# EasyEDA Pro project USB Hub.epro

# Schematic Schematic1
Board Name: Board1; Create Date: 2026-05-04; Page Name: P1; Project Name: USB Hub; Schematic Name: Schematic1; Update Date: 2026-05-04; Company: EasyEDA.com; Page Size: A4; Version: V1.0
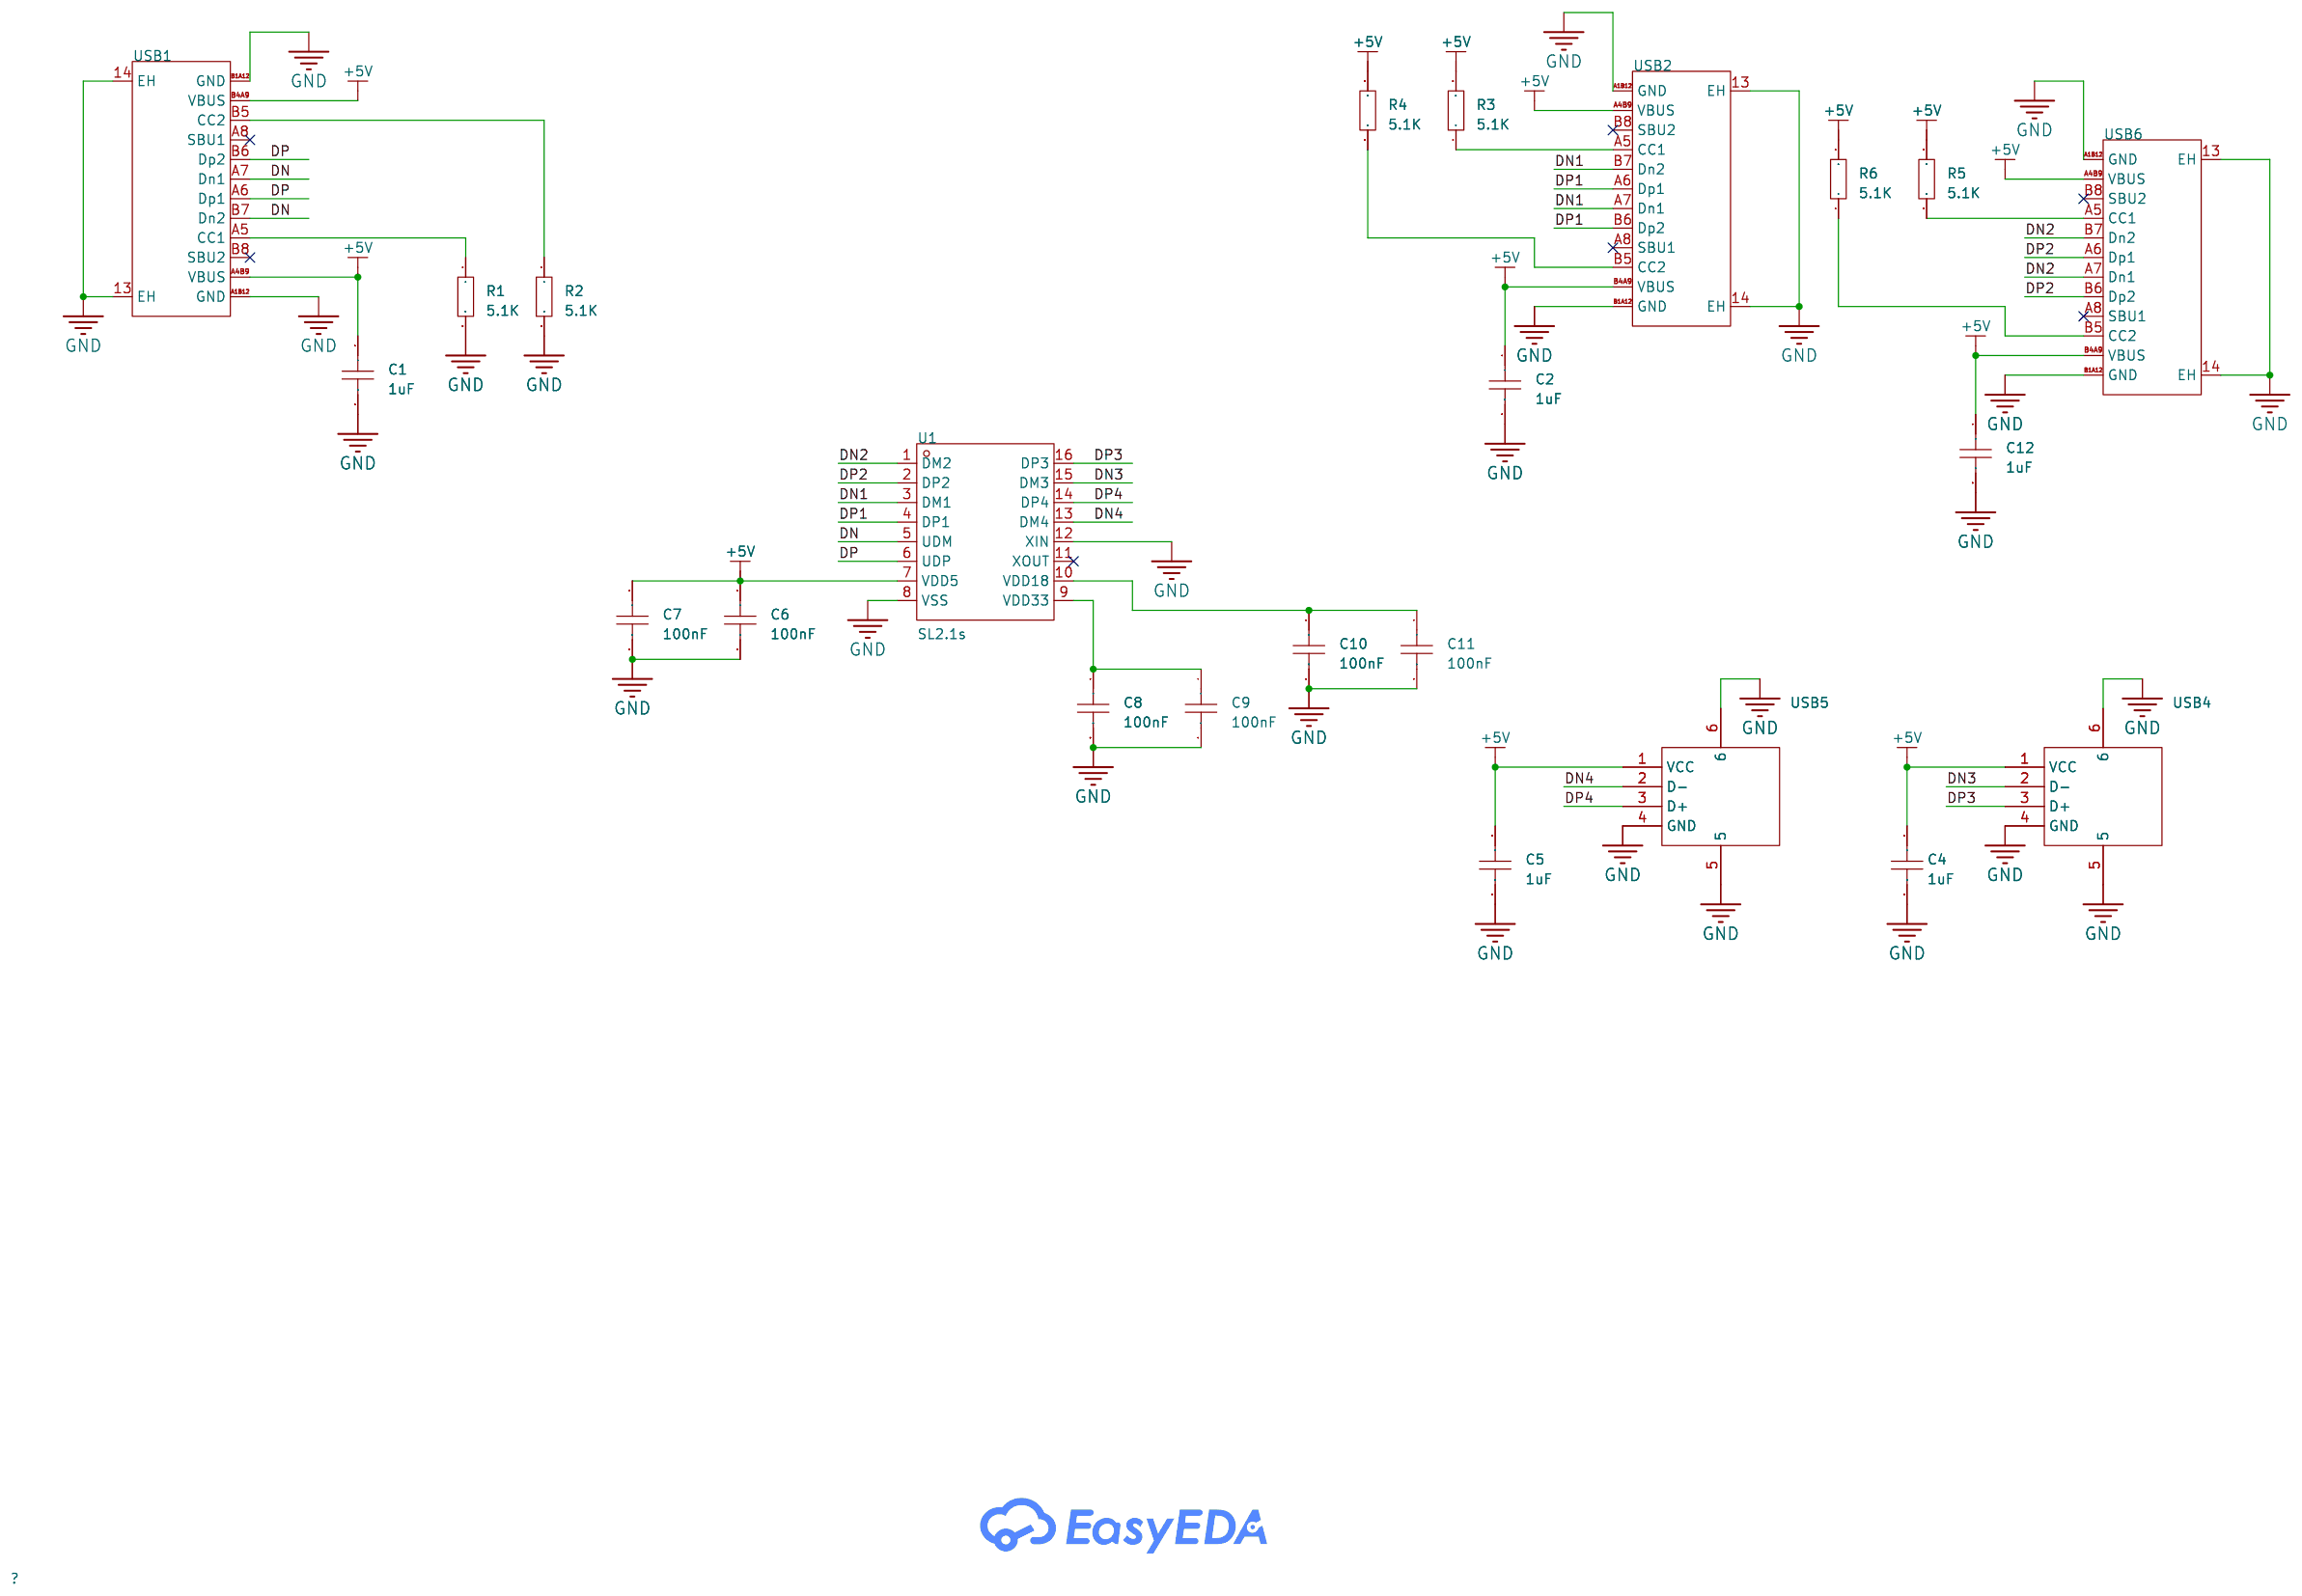
[diagram p0: schematic sheet]

## Parts
C1  1uF  [C0603]
C2  1uF  [C0603]
C4  1uF  [C0603]
C5  1uF  [C0603]
C6  100nF  [C0603]
C7  100nF  [C0603]
C8  100nF  [C0603]
C9  100nF  [C0603]
C10  100nF  [C0603]
C11  100nF  [C0603]
C12  1uF  [C0603]
R1  5.1K  [R0603]
R2  5.1K  [R0603]
R3  5.1K  [R0603]
R4  5.1K  [R0603]
R5  5.1K  [R0603]
R6  5.1K  [R0603]
U1  SL2.1s  [SSOP-16_L4.6-W2.6-P0.53-LS4.0-BL]
USB1  TYPE-C 16PIN 2MD(073)  [USB-C-SMD_TYPE-C-16PIN-2MD-073]
USB2  TYPE-C 16PIN 2MD(073)  [USB-C-SMD_TYPE-C-16PIN-2MD-073]
USB4  10.0 QHHTZB6.3  [USB-A-TH_10.0QHHTZB6.3]
USB5  10.0 QHHTZB6.3  [USB-A-TH_10.0QHHTZB6.3]
USB6  TYPE-C 16PIN 2MD(073)  [USB-C-SMD_TYPE-C-16PIN-2MD-073]

## Library data of the parts
C1 C2 C4-C12 = CAP_0603: Supplier Footprint: 0603
R1-R6 = Res_0603: Supplier Footprint: 0603
U1 = SL2.1s: type:Hub USB Protocol:USB 2.0 Data Rate:- Voltage - Supply:4V~5.25V Voltage - Supply:4V~5.25V Operating Temperature:0℃~+70℃ Operating Temperature:0℃~+70℃ Memory Interface:- Current - Supply:120mA Quiescent Supply Current:2.5mA Number of Channels:4; LCSC Part Name: USB2.0 HUB控制器集成电路; Supplier Part: C2684433; Manufacturer: CoreChips(和芯润德); Supplier Footprint: SSOP-16; JLCPCB Part Class: Extended Part; Datasheet: https://item.szlcsc.com/datasheet/SL2.1s/2782346.html; Supplier: LCSC; type: Hub; USB Protocol: USB 2.0; Voltage - Supply: 4V~5.25V; Operating Temperature: 0℃~+70℃; Current - Supply: 120mA; Quiescent Supply Current: 2.5mA; Number of Channels: 4
USB1 USB2 USB6 = TYPE-C 16PIN 2MD(073): Connector Type:Type-C Protocol Standard:- Gender:Female Mounting Type:Surface Mount, Right Angle Number of Contacts:16P Number of Ports:1 Current Rating-Power:3A Voltage Rating:5V Connect-Disconnect Life:10,000 Cycles Supplementary Features:- Center Heigh; LCSC Part Name: Type-C 母 卧贴; Supplier Part: C2765186; Manufacturer: SHOU HAN(首韩); Supplier Footprint: SMD; JLCPCB Part Class: Extended Part; Datasheet: https://item.szlcsc.com/datasheet/TYPE-C%252016PIN%25202MD(073)/2901843.html; Supplier: LCSC; Connector Type: Type-C; Gender: Female; Mounting Type: Surface Mount, Right Angle; Number of Contacts: 16P; Number of Ports: 1; Current Rating-Power: 3A; Voltage Rating: 5V; Connect-Disconnect Life: 10,000 Cycles; Detection color: Black; Operating Temperature: -25℃~+85℃
USB4 USB5 = 10.0 QHHTZB6.3: Connector Type:Type-A Protocol Standard:USB 2.0 Gender:Female Mounting Type:Surface Mount, Right Angle Number of Contacts:4P Number of Ports:1 Current Rating-Power:1.5A Voltage Rating:30V Connect-Disconnect Life:5,000 times Supplementary Features:- Center; LCSC Part Name: 壳长10.0mm; Supplier Part: C668591; Manufacturer: SHOU HAN(首韩); Supplier Footprint: SMD; JLCPCB Part Class: Extended Part; Datasheet: https://item.szlcsc.com/datasheet/10.0%2520QHHTZB6.3/698534.html; Supplier: LCSC; Connector Type: Type-A; Protocol Standard: USB 2.0; Gender: Female; Mounting Type: Surface Mount, Right Angle; Number of Contacts: 4P; Number of Ports: 1; Current Rating-Power: 1.5A; Voltage Rating: 30V; Connect-Disconnect Life: 5,000 times; Length: 10mm; Detection color: Black; Operating Temperature: -25℃~+85℃

## Nets
+5V: C1.1 C2.1 C4.1 C5.1 C6.1 C7.1 C12.1 R3.2 R4.2 R5.2 R6.2 U1.7(VDD5) USB1.A4B9(VBUS) USB1.B4A9(VBUS) USB2.A4B9(VBUS) USB2.B4A9(VBUS) USB4.1(VCC) USB5.1(VCC) USB6.A4B9(VBUS) USB6.B4A9(VBUS)
GND: C1.2 C2.2 C4.2 C5.2 C6.2 C7.2 C8.2 C9.2 C10.2 C11.2 C12.2 R1.2 R2.2 U1.8(VSS) U1.12(XIN) USB1.13(EH) USB1.14(EH) USB1.A1B12(GND) USB1.B1A12(GND) USB2.13(EH) USB2.14(EH) USB2.A1B12(GND) USB2.B1A12(GND) USB4.4(GND) USB4.5 USB4.6 USB5.4(GND) USB5.5 USB5.6 USB6.13(EH) USB6.14(EH) USB6.A1B12(GND) USB6.B1A12(GND)
DN: U1.5(UDM) USB1.A7(Dn1) USB1.B7(Dn2)
DN1: U1.3(DM1) USB2.A7(Dn1) USB2.B7(Dn2)
DN2: U1.1(DM2) USB6.A7(Dn1) USB6.B7(Dn2)
DN3: U1.15(DM3) USB4.2(D-)
DN4: U1.13(DM4) USB5.2(D-)
DP: U1.6(UDP) USB1.A6(Dp1) USB1.B6(Dp2)
DP1: U1.4(DP1) USB2.A6(Dp1) USB2.B6(Dp2)
DP2: U1.2(DP2) USB6.A6(Dp1) USB6.B6(Dp2)
DP3: U1.16(DP3) USB4.3(D+)
DP4: U1.14(DP4) USB5.3(D+)
$1N1728: R1.1 USB1.A5(CC1)
$1N1733: R2.1 USB1.B5(CC2)
$1N2038: R3.1 USB2.A5(CC1)
$1N2146: R4.1 USB2.B5(CC2)
$1N2912: C8.1 C9.1 U1.9(VDD33)
$1N2936: C10.1 C11.1 U1.10(VDD18)
$1N3312: R6.1 USB6.B5(CC2)
$1N3317: R5.1 USB6.A5(CC1)

Not connected (* = marked no-connect by the designer): U1 11(XOUT)*; USB1 A8(SBU1)* B8(SBU2)*; USB2 A8(SBU1)* B8(SBU2)*; USB6 A8(SBU1)* B8(SBU2)*

# Board PCB1
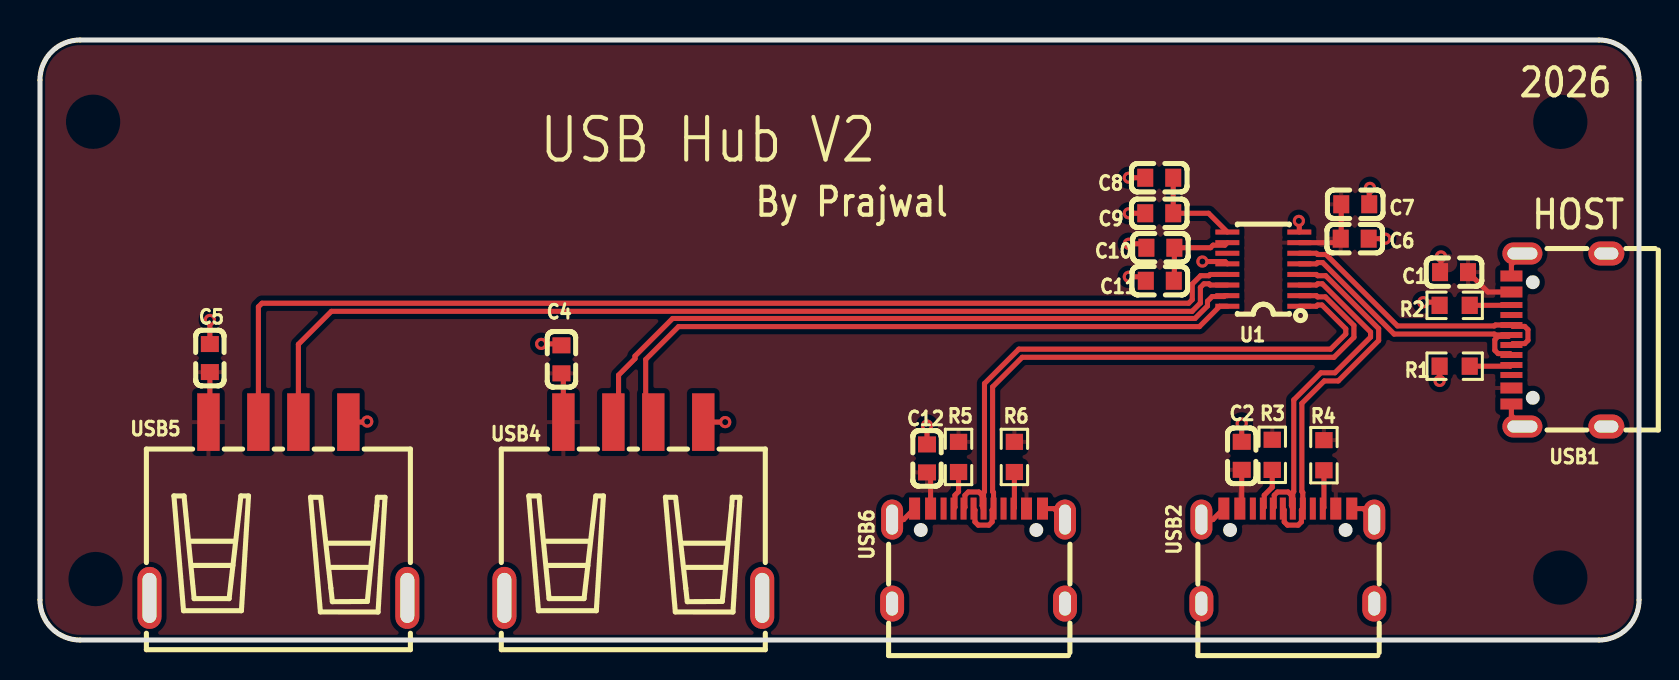
[diagram p1: board, top side]
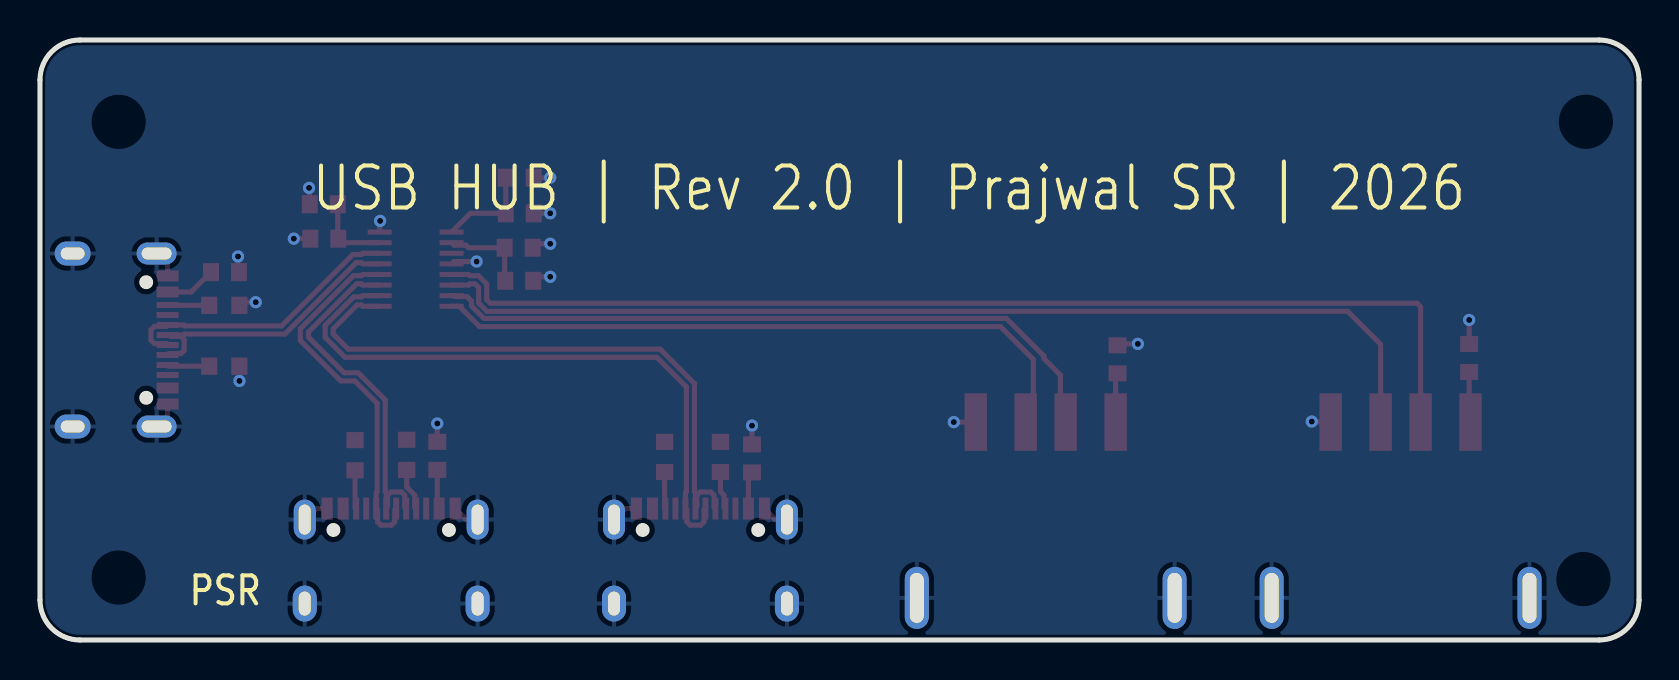
[diagram p2: board, bottom side, seen from below]

Outline 80 x 30 mm; copper layers: Top Layer, Bottom Layer. Coordinates in mm from the lower left corner of the outline.
Outline path: 0,28 0,2 arc(0.59,0.59) 2,0 78,0 arc(79.41,0.59) 80,2 80,28 arc(79.41,29.41) 78,30 2,30 arc(0.59,29.41) 0,28
Stack: Top Layer 0.035mm / Dielectric1 1.51mm FR4 er 4.5 / Bottom Layer 0.035mm

## Design rules (mm)
net DN2: DP5
net DP2: DP5
net DN1: DP3
net DP1: DP3
net DN: DP2
net DP: DP2
net DN4: DP1
net DP4: DP1
net DN3: DP4
net DP3: DP4
template: Custom Config
spacing copperThickness1oz (default): track to track 0.102, other pairs 0.152 to 0.3
spacing copperThickness2oz: track to track 0.203, other pairs 0.152 to 0.3
track width copperThickness1oz (default): min 0.127, default 0.254, max 2.54
track width copperThickness2oz: min 0.203, default 0.254, max 2.54
differential pair differentialPair (default): width min 0.127, default 0.254, max 2.54; gap min 0.152, default 0.152
via viaSize (default): diameter min 0.5, default 0.61, max 10; hole min 0.3, default 0.305, max 6.3

## Placement (name value [footprint] x y rotation side)
C1  1uF  [C0603]  70.74 18.39 180 top
C2  1uF  [C0603]  60.12 9.21 90 top
C4  1uF  [C0603]  26.09 14.03 90 top
C5  1uF  [C0603]  8.5 14.1 90 top
C6  100nF  [C0603]  65.78 20.07 0 top
C7  100nF  [C0603]  65.8 21.79 0 top
C8  100nF  [C0603]  56 23.11 180 top
C9  100nF  [C0603]  56 21.34 180 top
C10  100nF  [C0603]  56.05 19.61 180 top
C11  100nF  [C0603]  56.02 17.96 180 top
C12  1uF  [C0603]  44.38 9.08 90 top
R1  5.1K  [R0603]  70.78 13.69 180 top
R2  5.1K  [R0603]  70.78 16.73 180 top
R3  5.1K  [R0603]  61.65 9.26 90 top
R4  5.1K  [R0603]  64.24 9.24 90 top
R5  5.1K  [R0603]  45.96 9.15 90 top
R6  5.1K  [R0603]  48.75 9.15 90 top
U1  SL2.1s  [SSOP-16_L4.6-W2.6-P0.53-LS4.0-BL]  61.2 18.54 90 top
USB1  TYPE-C 16PIN 2MD(073)  [USB-C-SMD_TYPE-C-16PIN-2MD-073]  75.99 15 90 top
USB2  TYPE-C 16PIN 2MD(073)  [USB-C-SMD_TYPE-C-16PIN-2MD-073]  62.43 4.2 0 top
USB4  10.0 QHHTZB6.3  [USB-A-TH_10.0QHHTZB6.3]  29.68 6.5 0 top
USB5  10.0 QHHTZB6.3  [USB-A-TH_10.0QHHTZB6.3]  11.93 6.5 0 top
USB6  TYPE-C 16PIN 2MD(073)  [USB-C-SMD_TYPE-C-16PIN-2MD-073]  46.96 4.2 0 top

## Footprints (pads in the part's own frame, mm; a bottom-side part is the same pattern mirrored in y, then rotated)
C0603
  rect 0.8x0.9 smd: 1(-0.7,0) 2(0.7,0)
R0603
  rect 0.806x0.864 smd: 1(-0.753,0) 2(0.753,0)
SSOP-16_L4.6-W2.6-P0.53-LS4.0-BL
  rect 0.25x1.2 smd: 1(-1.855,-1.8) 2(-1.325,-1.8) 3(-0.795,-1.8) 4(-0.265,-1.8) 5(0.265,-1.8) 6(0.795,-1.8) 7(1.325,-1.8) 8(1.855,-1.8) 9(1.855,1.8) 10(1.325,1.8) 11(0.795,1.8) 12(0.265,1.8) 13(-0.265,1.8) 14(-0.795,1.8) 15(-1.325,1.8) 16(-1.855,1.8)
USB-A-TH_10.0QHHTZB6.3
  rect 1.12x2.88 smd: 1(-3.5,4.395) 2(-1,4.395) 3(1,4.395) 4(3.5,4.395)
  oval 1.2x3.1 hole 0.7x2.5: 5(-6.45,-4.395) 6(6.45,-4.395)
USB-C-SMD_TYPE-C-16PIN-2MD-073
  oval 1.1x2 hole 0.6x1.5: 13(-4.325,1.825) 14(4.325,1.825)
  oval 1.2x1.8 hole 0.6x1.2: 13(-4.325,-2.375) 14(4.325,-2.375)
  rect 0.55x1.1 smd: A1B12(-3.2,2.375) A4B9(-2.4,2.375) B1A12(3.2,2.375) B4A9(2.4,2.375)
  rect 0.3x1.1 smd: A5(-1.25,2.375) A6(-0.25,2.375) A7(0.25,2.375) A8(1.25,2.375) B5(1.75,2.375) B6(0.75,2.375) B7(-0.75,2.375) B8(-1.75,2.375)

## Nets
As in the schematic.

Pads without a net: U1 11; USB1 A8 B8; USB2 A8 B8; USB6 A8 B8

## Via types
v1: diameter 0.61, hole 0.305, Top Layer to Bottom Layer, 17 vias

## Routing (per net, layer and track width the routed paths; a pad name or vN(x,y) marks a point on that pad's centre or on a via; arc(x,y) is an arc through that point)
+5V: length 15.3
  Top Layer w0.254: U1.7 64.88,19.87 C6.1 65.1,20.09 C7.1 ; USB4.1 26.18,13.24 C4.1 ; C2.1 60.12,6.66 USB2.A4B9 ; C5.1 8.5,10.97 USB5.1 ; USB1.B4A9 72.44,17.4 71.45,18.39 ; USB6.A4B9 44.56,8.2 44.38,8.38
GND: length 23.8
  Top Layer w0.254: v1(54.47,19.81) 55.15,19.81 C10.2 ; U1.12 59.29,18.92 v1(58.16,18.92) ; USB6.B1A12 50.73,6.57 USB6.14 ; USB1.13 73.61,11.22 USB1.A1B12 ; R2.2 69.86,16.89 v1(69.2,16.89) ; v1(66.54,22.61) 66.5,22.57 C7.2 ; v1(70.09,19.18) 70.09,18.44 C1.2 ; v1(8.5,16) C5.2 ; USB1.B1A12 73.61,18.78 USB1.14 ; C4.2 26.02,14.81 v1(25.07,14.81) ; C11.2 55.13,18.16 v1(54.47,18.16) ; v1(34.28,10.89) USB4.4 ; C8.2 v1(54.47,23.11) ; v1(16.37,10.92) 16.35,10.89 USB5.4 ; v1(62.98,20.95) 63,20.93 U1.8 ; v1(44.38,10.72) C12.2 ; USB6.A1B12 43.21,6.02 USB6.13 ; R1.2 v1(70.02,12.95) ; C6.2 v1(67.3,20.07) ; C9.2 v1(54.47,21.34) ; v1(60.12,10.83) C2.2 ; USB2.13 58.68,6.02 USB2.A1B12 ; USB2.B1A12 66.2,6.57 USB2.14
DN: length 14.5
  Top Layer w0.254: USB1.B7 73.54,14.32 72.95,14.32 72.79,14.48 72.79,15.02 72.95,15.18 73.47,15.18 73.52,15.23 73.59,15.23 USB1.A7 72.81,15.25 72.76,15.3 67.75,15.3 64.17,18.87 63.92,18.87 63.86,18.81 U1.5
DN1: length 17.8
  Top Layer w0.254: USB2.B7 61.75,6.64 61.75,7.24 61.91,7.4 62.45,7.4 62.61,7.24 62.61,6.72 62.66,6.67 62.66,6.59 USB2.A7 62.68,7.38 62.73,7.42 62.73,12 64.08,13.36 64.79,13.36 66.57,15.14 66.57,15.4 64.16,17.81 63.92,17.81 63.86,17.75 U1.3
DN2: length 30.9
  Top Layer w0.254: U1.1 63.86,16.69 63.92,16.75 64.14,16.75 65.33,15.56 65.33,15.3 64.57,14.54 48.97,14.54 47.25,12.82 47.25,7.42 47.21,7.38 USB6.A7 47.18,6.59 47.18,6.67 47.14,6.72 47.14,7.24 46.97,7.4 46.44,7.4 46.28,7.24 46.28,6.64 USB6.B7
DN3: length 34.8
  Top Layer w0.254: U1.15 59.28,17.22 59.23,17.17 58.64,17.17 58.41,16.94 58.41,16.7 57.78,16.08 31.65,16.08 29.77,14.2 29.77,14.07 28.95,13.24 28.95,11.16 USB4.2
DN4: length 55.4
  Top Layer w0.254: USB5.2 10.93,16.66 11.11,16.84 57.47,16.84 57.65,17.02 57.65,17.8 58.07,18.22 58.49,18.22 58.55,18.28 U1.13
DP: length 14.5
  Top Layer w0.254: USB1.A6 73.69,14.82 74.28,14.82 74.44,14.98 74.44,15.52 74.28,15.68 73.69,15.68 USB1.B6 72.81,15.75 72.76,15.7 67.91,15.7 64.34,19.28 63.92,19.28 63.86,19.34 U1.6
DP1: length 18.5
  Top Layer w0.254: USB2.A6 62.25,6.5 62.25,5.91 62.41,5.74 62.95,5.74 63.11,5.91 63.11,6.5 USB2.B6 63.18,7.38 63.13,7.42 63.13,11.83 64.25,12.95 64.95,12.95 66.97,14.97 66.97,15.56 64.32,18.22 63.92,18.22 63.86,18.28 U1.4
DP2: length 31.5
  Top Layer w0.254: USB6.A6 46.78,6.5 46.78,5.91 46.94,5.74 47.47,5.74 47.64,5.91 47.64,6.5 USB6.B6 47.71,7.38 47.66,7.42 47.66,12.66 49.14,14.14 64.74,14.14 65.74,15.13 65.74,15.72 64.31,17.16 63.92,17.16 63.86,17.22 U1.2
DP3: length 33.5
  Top Layer w0.254: USB4.3 30.3,11.28 30.3,14.03 31.95,15.67 58.01,15.67 59.02,16.69 U1.16
DP4: length 52.1
  Top Layer w0.254: U1.14 58.55,17.75 58.49,17.81 58.23,17.81 58.05,17.63 58.05,16.85 57.64,16.43 14.58,16.43 12.93,14.78 USB5.3
$1N1728: length 2.1
  Top Layer w0.254: R1.1 73.55,13.69 USB1.A5
$1N1733: length 2.1
  Top Layer w0.254: R2.1 73.6,16.73 USB1.B5
$1N2038: length 2.1
  Top Layer w0.254: USB2.A5 61.25,6.64 61.25,7.24 61.65,7.64 R3.1
$1N2146: length 1.9
  Top Layer w0.254: R4.1 64.24,6.63 USB2.B5
$1N2912: length 4.9
  Top Layer w0.254: U1.9 58.46,21.34 C9.1 C8.1
$1N2936: length 4.4
  Top Layer w0.254: C11.1 56.75,17.99 56.75,19.61 58.56,19.61 58.69,19.74 59.28,19.74 U1.10
$1N3312: length 1.8
  Top Layer w0.254: R6.1 48.75,6.61 USB6.B5
$1N3317: length 1.9
  Top Layer w0.254: R5.1 45.96,7.42 45.78,7.24 45.78,6.64 USB6.A5

## Copper pours and planes (outline as drawn; the poured copper is in the pictures)
+5V on Top Layer: -4.45,33.91 97.27,33.91 97.27,-8.13 -4.45,-8.13
GND on Bottom Layer: -5.85,35.81 89.4,35.81 89.4,-8.51 -5.85,-8.51

## Text on the board
Bottom Silkscreen Layer: PSR | USB HUB | Rev 2.0 | Prajwal SR | 2026
Top Silkscreen Layer: By Prajwal | 2026 | HOST | USB Hub V2
